# EasyEDA schematic SCH_GPS Tracker TTGO_2024-01-23.json
TITLE: TTGO GPS TRACKING; REV: 1.0; Date: 2020-02-29; Sheet: 1/1; Drawn By: harshthk; Company: TECHIESMS
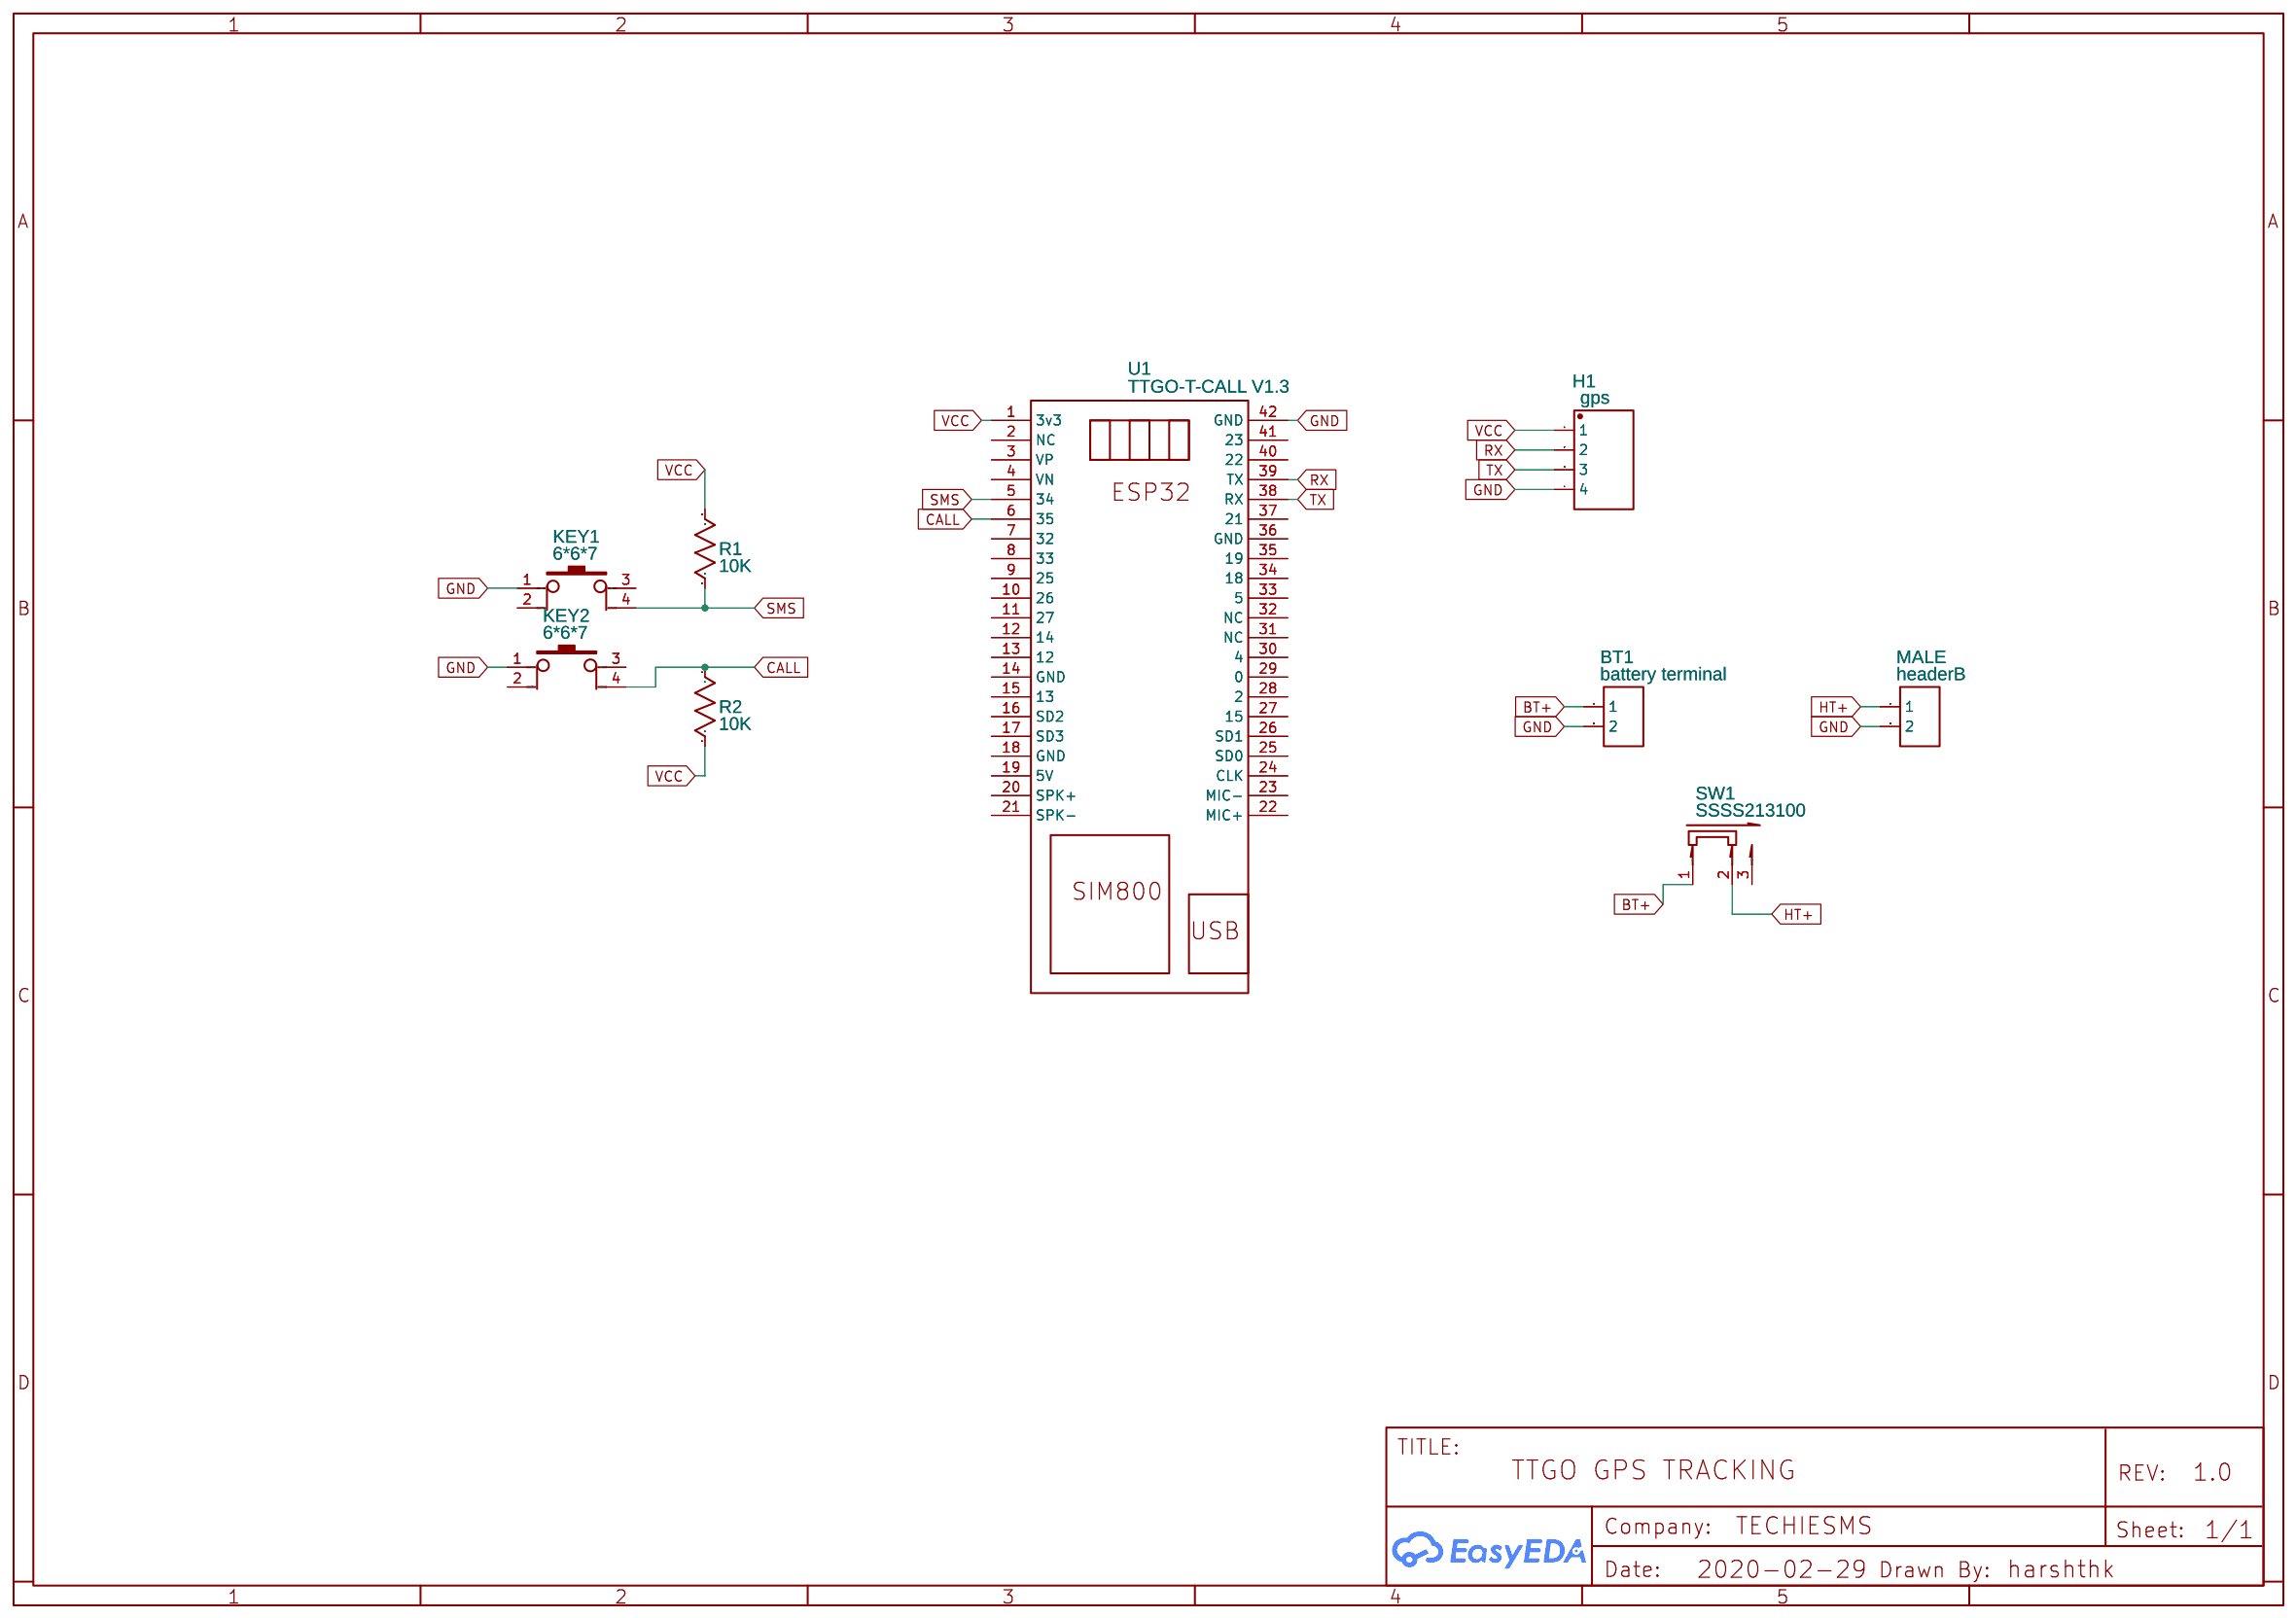
[diagram p0: schematic sheet]

## Parts
BT1  battery terminal  [HDR-TH_2P-P2.54-V-M]
H1  gps  [210S-1X4P]
KEY1  6*6*7  [KEY-6.0*6.0-2]
KEY2  6*6*7  [KEY-6.0*6.0-2]
MALE  headerB  [HDR-TH_2P-P2.54-V-M]
R1  10K  [AXIAL-0.3]
R2  10K  [AXIAL-0.3]
SW1  SSSS213100  [SSSS213100]
U1  TTGO-T-CALL V1.3  [TTGO-T-CALL V1.3]

## Library data of the parts
BT1 MALE = Header-Female-2.54_1x2: Supplier: LCSC; Manufacturer: BOOMELE; Manufacturer Part: 2.54-1*2PFemale; image: //image.lceda.cn/szlcsc/C49661.jpg; Supplier Part: C49661
H1 = Header-Male-2.54_1x4: Supplier: LCSC; Manufacturer: Ckmtw; Manufacturer Part: 210S-1*4P L=11.6MMGold-plated black; Contributor: LCSC; Supplier Part: C124378
KEY1 KEY2 = 6*6*7: Supplier Part: C69055; Supplier: LCSC; Manufacturer: ReliaPro
R1 R2 = Res_AXIAL-0.3(1/8W)_US
SW1 = SSSS213100: Supplier: LCSC; Manufacturer: ALPS; Supplier Part: C115374
U1 = TTGO-T-CALL V1.3: Contributor: SAURABH DAKHORE

## Nets
GND: BT1.2 H1.4 KEY1.1 KEY2.1 MALE.2 U1.42(GND)
VCC: H1.1 R1.2 R2.2 U1.1(3v3)
BT+: BT1.1 SW1.1
CALL: KEY2.4 R2.1 U1.6(35)
HT+: MALE.1 SW1.2
RX: H1.2 U1.39(TX)
SMS: KEY1.4 R1.1 U1.5(34)
TX: H1.3 U1.38(RX)

Not connected (* = marked no-connect by the designer): KEY1 2 3; KEY2 2 3; SW1 3; U1 2(NC) 3(VP) 4(VN) 7(32) 8(33) 9(25) 10(26) 11(27) 12(14) 13(12) 14(GND) 15(13) 16(SD2) 17(SD3) 18(GND) 19(5V) 20(SPK+) 21(SPK-) 22(MIC+) 23(MIC-) 24(CLK) 25(SD0) 26(SD1) 27(15) 28(2) 29(0) 30(4) 31(NC) 32(NC) 33(5) 34(18) 35(19) 36(GND) 37(21) 40(22) 41(23)
